# Altium schematic sheet LCD.SchDoc
size 203 x 152 mm; SheetNumber: 13; SheetTotal: 15
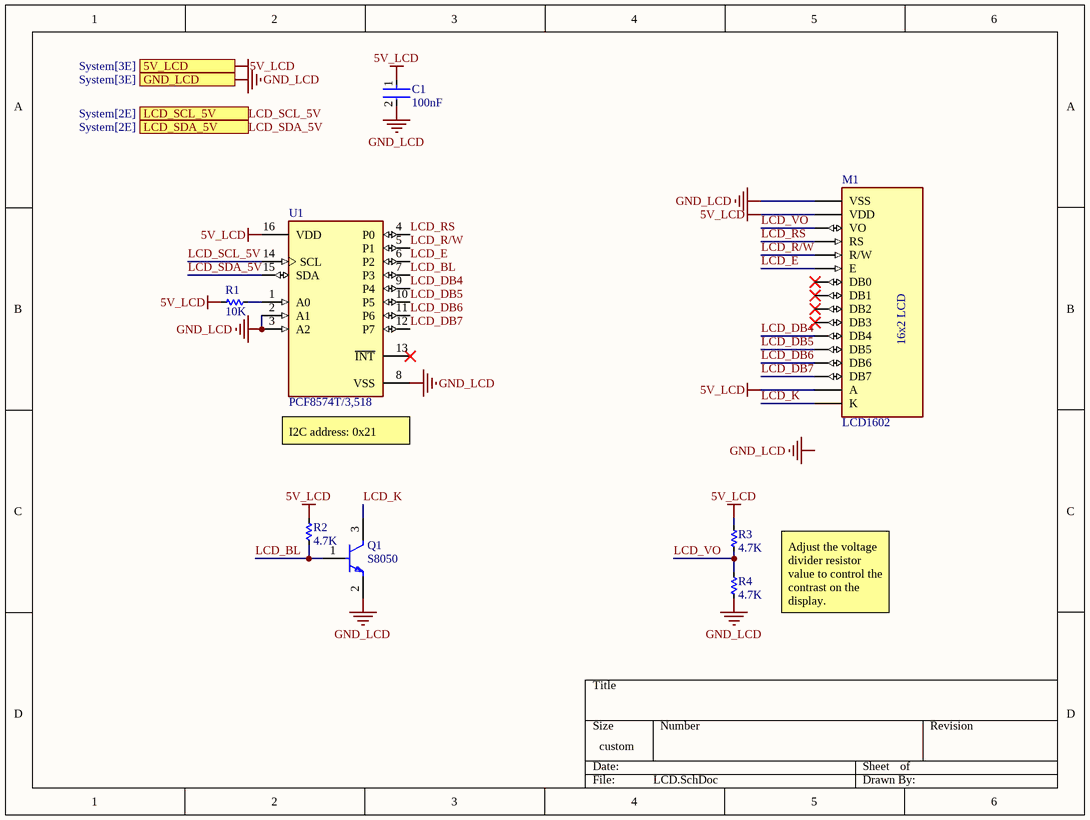
[diagram p0: LCD.SchDoc]

## Parts
C1  100nF  [FP-GRM18-0_15-MFG]
M1  LCD1602  [LCD1602']
Q1  S8050  [FP-SS8050-G-IPC_A]
R1  10K  [RES-SMD-0603]
R2  4.7K  [RES-SMD-0603]
R3  4.7K  [RES-SMD-0603]
R4  4.7K  [RES-SMD-0603]
U1  PCF8574T/3,518  [FP-SOT162-1-IPC_B]

## Ports
5V_LCD (see System[3E]), GND_LCD (see System[3E]), LCD_SCL_5V (see System[2E]), LCD_SDA_5V (see System[2E])

## Nets
5V_LCD: C1.1 M1.2(VDD) M1.15(A) R1.2 R2.1 R3.1 U1.16(VDD) ; port 5V_LCD
GND_LCD: C1.2 M1.1(VSS) Q1.2(E) R4.2 U1.2(A1) U1.3(A2) U1.8(VSS) ; port GND_LCD
LCD_BL: Q1.1(B) R2.2 U1.7(P3)
LCD_DB4: M1.11(DB4) U1.9(P4)
LCD_DB5: M1.12(DB5) U1.10(P5)
LCD_DB6: M1.13(DB6) U1.11(P6)
LCD_DB7: M1.14(DB7) U1.12(P7)
LCD_E: M1.6(E) U1.6(P2)
LCD_K: M1.16(K) Q1.3(C)
LCD_R/W: M1.5(R/W) U1.5(P1)
LCD_RS: M1.4(RS) U1.4(P0)
LCD_SCL_5V: U1.14(SCL) ; port LCD_SCL_5V
LCD_SDA_5V: U1.15(SDA) ; port LCD_SDA_5V
LCD_VO: M1.3(VO) R3.2 R4.1
NetR1_1: R1.1 U1.1(A0)

Not connected (* = marked no-connect by the designer): M1 7(DB0)* 8(DB1)* 9(DB2)* 10(DB3)*; U1 13(~{INT})*

## Notes on the sheet
- (near U1) I2C address: 0x21
- Adjust the voltage divider resistor value to control the contrast on the display.
- Labels drawn without touching a wire or pin: GND_LCD
- (in symbol LCD1602) 16x2 LCD

## Library data of the parts
C1 = CMP-2000-05448-2: CAP CER 104 0603; Manufacturer Part Number: GRM188R61A106KE69D; Manufacturer: Murata; Temperature Coefficient: 15%; Value: 10uF; Temperature Characteristic: X5R; Material: Ceramic; Tolerance: 10%; Voltage Rating: 10V; Device Class L1: Passive Components; ComponentLink2Description: Datasheet; Height: 0.95mm; Package: GRM18-0.15; Octopart: https://octopart.com/grm188r61a106ke69d-murata-22851381; Digikey Description: CAP CER 10UF 10V X5R 0603; Temperature Range High: +85°C; Temperature Range Low: -55°C; Capacitance: 10uF; RoHS: TRUE; Device Class L2: Capacitors; ComponentLink2URL: https://search.murata.co.jp/Ceramy/image/img/A01X/G101/ENG/GRM188R61A106KE69-01A.pdf; Device Class L3: Ceramic Capacitors; Lead Free: Yes; Mouser Description: Multilayer Ceramic Capacitors MLCC - SMD/SMT 0603 10uF 10volts X5R + - 10%; Category: Cap; Temperature: -55°C to +85°C; Automotive: No
Q1 = CMP-20235-000001-1: S8050 J3Y MBT8050LT1G NPN Transistor 0.5A 40V SOT-23; Max Collector Current: 1.5A; Transition Frequency: 100MHz; Max Breakdown Voltage: 25V; Collector Emitter Voltage (VCEO): 400mV; Max Power Dissipation: 300mW; Case/Package: TO-236-3; Packaging: Tape and Reel; RoHS Compliant: Yes; Mount: Surface Mount; Collector Emitter Breakdown Voltage: 25V
R1-R4 = Res-SMD: Res 0603 5%; Manufacturer: Generic Components; Class: Passive; Published: 08/06/2000; Publisher: Altium Hobart Technology Centre
U1 = CMP-10112-000010-1: IC I/O EXPANDER I2C 8B 16SOIC; Manufacturer: NXP Semiconductors; Frequency: 100kHz; Max Supply Voltage: 6V; Standoff Height: 0.1mm; Nominal Supply Current: 40uA; Max Junction Temp: +125°C; Min Supply Voltage: 2.5V; Number Of I/Os: 8; Manufacturer Part Number: PCF8574T/3,518; Footprint Url: https://www.nxp.com/docs/en/package-information/SOT162-1.pdf; ComponentLink2URL: https://www.nxp.com/docs/en/data-sheet/PCF8574_PCF8574A.pdf; Automotive: No; Digikey Description: IC I/O EXPANDER I2C 8B 16SOIC; Mouser Description: PCF8574 Series 2.5 - 6V Remote 8-bit I/O Expander for I2C-bus - SOIC-16; Ipc Land Pattern Name: SOIC127P1032X265-16; Interface: I2C; Octopart: https://octopart.com/pcf8574t%2F3%2C518-nxp+semiconductors-10470852; Ambient Temperature Range Low: -40°C; Lead Free: Yes; Device Class L2: Interface ICs; Temperature Range High: +85°C; Device Class L1: Integrated Circuits (ICs); Package: SOT162-1; ComponentLink2Description: Datasheet; Device Class L3: I/O Expanders; Temperature: -40°C to +85°C; Ambient Temperature Range High: +85°C; Height: 2.65mm; Category: IC; RoHS: TRUE; Temperature Range Low: -40°C